# Altium schematic sheet MAX5875_6.SchDoc
size A; SheetNumber: 19; SheetTotal: 24
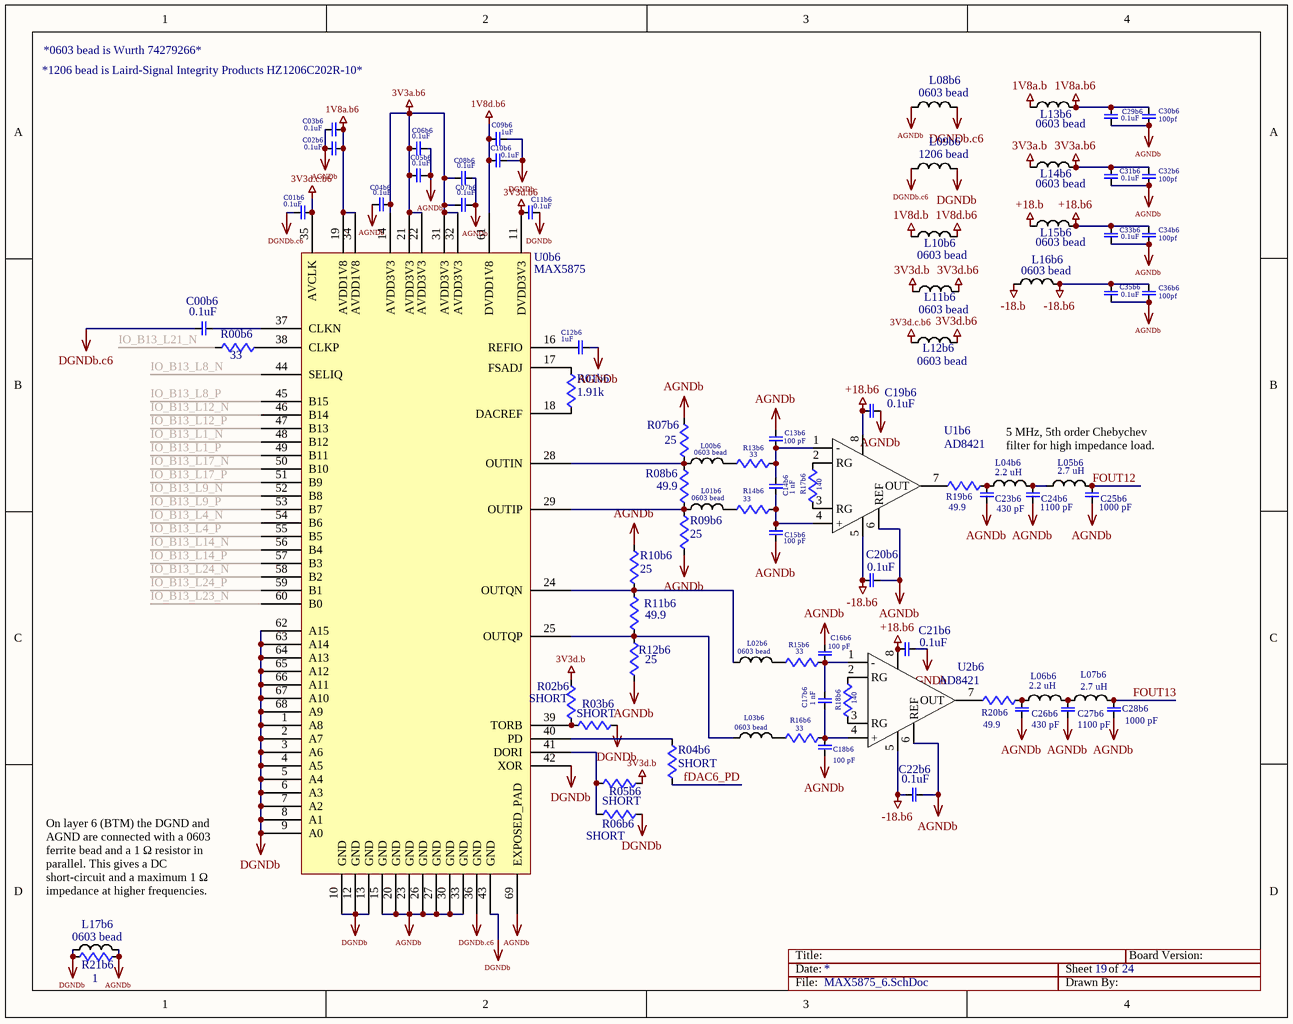
[diagram p0: MAX5875_6.SchDoc]

## Parts
C00b6  0.1uF  [0402]
C01b6  0.1uF  [0402]
C02b6  0.1uF  [0402]
C03b6  0.1uF  [0402]
C04b6  0.1uF  [0402]
C05b6  0.1uF  [0402]
C06b6  0.1uF  [0402]
C07b6  0.1uF  [0402]
C08b6  0.1uF  [0402]
C09b6  1uF  [0603]
C10b6  0.1uF  [0402]
C11b6  0.1uF  [0402]
C12b6  1uF  [0402]
C13b6  100 pF  [0603]
C14b6  1 nF  [0603]
C15b6  100 pF  [0603]
C16b6  100 pF  [0603]
C17b6  1 nF  [0603]
C18b6  100 pF  [0603]
C19b6  0.1uF  [0603]
C20b6  0.1uF  [0603]
C21b6  0.1uF  [0603]
C22b6  0.1uF  [0603]
C23b6  430 pF  [0603]
C24b6  1100 pF  [0603]
C25b6  1000 pF  [0603]
C26b6  430 pF  [0603]
C27b6  1100 pF  [0603]
C28b6  1000 pF  [0603]
C29b6  0.1uF  [0603]
C30b6  100pf  [0603]
C31b6  0.1uF  [0603]
C32b6  100pf  [0603]
C33b6  0.1uF  [0603]
C34b6  100pf  [0603]
C35b6  0.1uF  [0603]
C36b6  100pf  [0603]
L00b6  0603 bead  [0603]
L01b6  0603 bead  [0603]
L02b6  0603 bead  [0603]
L03b6  0603 bead  [0603]
L04b6  2.2 uH  [0603]
L05b6  2.7 uH  [0603]
L06b6  2.2 uH  [0603]
L07b6  2.7 uH  [0603]
L08b6  0603 bead  [0603]
L09b6  1206 bead  [1206]
L10b6  0603 bead  [0603]
L11b6  0603 bead  [0603]
L12b6  0603 bead  [0603]
L13b6  0603 bead  [0603]
L14b6  0603 bead  [0603]
L15b6  0603 bead  [0603]
L16b6  0603 bead  [0603]
L17b6  0603 bead  [0603]
R00b6  33  [0402]
R01b6  1.91k  [0603]
R02b6  SHORT  [0603]
R03b6  SHORT  [0603]
R04b6  SHORT  [0603]
R05b6  SHORT  [0603]
R06b6  SHORT  [0603]
R07b6  25  [0603]
R08b6  49.9  [0603]
R09b6  25  [0603]
R10b6  25  [0603]
R11b6  49.9  [0603]
R12b6  25  [0603]
R13b6  33  [0603]
R14b6  33  [0603]
R15b6  33  [0603]
R16b6  33  [0603]
R17b6  140  [0402]
R18b6  140  [0402]
R19b6  49.9  [0603]
R20b6  49.9  [0603]
R21b6  1  [0603]
U0b6  MAX5875  [68LQFN]
U1b6  AD8421  [8SOIC]
U2b6  AD8421  [8SOIC]

## Nets
1V8a.b: L13b6.1
1V8a.b6: C02b6.1 C03b6.2 C29b6.1 C30b6.1 L13b6.2 U0b6.19(AVDD1V8) U0b6.34(AVDD1V8)
1V8d.b: L10b6.1
1V8d.b6: C09b6.2 C10b6.2 L10b6.2 U0b6.61(DVDD1V8)
3V3a.b: L14b6.1
3V3a.b6: C04b6.1 C05b6.2 C06b6.1 C07b6.2 C08b6.1 C31b6.1 C32b6.1 L14b6.2 U0b6.14(AVDD3V3) U0b6.21(AVDD3V3) U0b6.22(AVDD3V3) U0b6.31(AVDD3V3) U0b6.32(AVDD3V3)
3V3d.b: L11b6.1 R02b6.2 R05b6.2
3V3d.b6: C11b6.2 L11b6.2 L12b6.2 U0b6.11(DVDD3V3)
3V3d.c.b6: C01b6.1 L12b6.1 U0b6.35(AVCLK)
+18.b: L15b6.1
+18.b6: C19b6.2 C21b6.2 C33b6.1 C34b6.1 L15b6.2 U1b6.8(+VS) U2b6.8(+VS)
-18.b: L16b6.1
-18.b6: C20b6.2 C22b6.2 C35b6.1 C36b6.1 L16b6.2 U1b6.5(-VS) U2b6.5(-VS)
AGNDb: C02b6.2 C03b6.1 C04b6.2 C05b6.1 C06b6.2 C07b6.1 C08b6.2 C12b6.1 C13b6.1 C15b6.1 C16b6.1 C18b6.1 C19b6.1 C20b6.1 C21b6.1 C22b6.1 C23b6.2 C24b6.2 C25b6.2 C26b6.2 C27b6.2 C28b6.2 C29b6.2 C30b6.2 C31b6.2 C32b6.2 C33b6.2 C34b6.2 C35b6.2 C36b6.2 L08b6.1 L17b6.2 R07b6.2 R09b6.1 R10b6.2 R12b6.1 R21b6.1 U0b6.15(GND) U0b6.20(GND) U0b6.23(GND) U0b6.26(GND) U0b6.27(GND) U0b6.30(GND) U0b6.33(GND) U0b6.69(EXPOSED_PAD) U1b6.6(REF) U2b6.6(REF)
DGNDb: C09b6.1 C10b6.1 C11b6.1 L09b6.2 L17b6.1 R03b6.2 R06b6.2 R21b6.2 U0b6.1(A8) U0b6.2(A7) U0b6.3(A6) U0b6.4(A5) U0b6.5(A4) U0b6.6(A3) U0b6.7(A2) U0b6.8(A1) U0b6.9(A0) U0b6.10(GND) U0b6.12(GND) U0b6.13(GND) U0b6.42(XOR) U0b6.43(GND) U0b6.62(A15) U0b6.63(A14) U0b6.64(A13) U0b6.65(A12) U0b6.66(A11) U0b6.67(A10) U0b6.68(A9)
DGNDb.c6: C00b6.2 C01b6.2 L08b6.2 L09b6.1 U0b6.36(GND)
fDAC6_PD: R04b6.2
FOUT12: C25b6.1 L05b6.2
FOUT13: C28b6.1 L07b6.2
IO_B13_L1_N: U0b6.48(B12)
IO_B13_L1_P: U0b6.49(B11)
IO_B13_L4_N: U0b6.54(B6)
IO_B13_L4_P: U0b6.55(B5)
IO_B13_L8_N: U0b6.44(SELIQ)
IO_B13_L8_P: U0b6.45(B15)
IO_B13_L9_N: U0b6.52(B8)
IO_B13_L9_P: U0b6.53(B7)
IO_B13_L12_N: U0b6.46(B14)
IO_B13_L12_P: U0b6.47(B13)
IO_B13_L14_N: U0b6.56(B4)
IO_B13_L14_P: U0b6.57(B3)
IO_B13_L17_N: U0b6.50(B10)
IO_B13_L17_P: U0b6.51(B9)
IO_B13_L21_N: R00b6.1
IO_B13_L23_N: U0b6.60(B0)
IO_B13_L24_N: U0b6.58(B2)
IO_B13_L24_P: U0b6.59(B1)
NetC00b6_1: C00b6.1 U0b6.37(CLKN)
NetC12b6_2: C12b6.2 U0b6.16(REFIO)
NetC13b6_2: C13b6.2 C14b6.1 R13b6.1 U1b6.1(-)
NetC14b6_2: C14b6.2 C15b6.2 R14b6.1 U1b6.4(+)
NetC16b6_2: C16b6.2 C17b6.1 R15b6.1 U2b6.1(-)
NetC17b6_2: C17b6.2 C18b6.2 R16b6.1 U2b6.4(+)
NetC23b6_1: C23b6.1 L04b6.1 R19b6.2
NetC24b6_1: C24b6.1 L04b6.2 L05b6.1
NetC26b6_1: C26b6.1 L06b6.1 R20b6.2
NetC27b6_1: C27b6.1 L06b6.2 L07b6.1
NetL00b6_1: L00b6.1 R07b6.1 R08b6.2 U0b6.28(OUTIN)
NetL00b6_2: L00b6.2 R13b6.2
NetL01b6_1: L01b6.1 R08b6.1 R09b6.2 U0b6.29(OUTIP)
NetL01b6_2: L01b6.2 R14b6.2
NetL02b6_1: L02b6.1 R10b6.1 R11b6.2 U0b6.24(OUTQN)
NetL02b6_2: L02b6.2 R15b6.2
NetL03b6_1: L03b6.1 R11b6.1 R12b6.2 U0b6.25(OUTQP)
NetL03b6_2: L03b6.2 R16b6.2
NetR00b6_2: R00b6.2 U0b6.38(CLKP)
NetR01b6_1: R01b6.1 U0b6.18(DACREF)
NetR01b6_2: R01b6.2 U0b6.17(FSADJ)
NetR02b6_1: R02b6.1 R03b6.1 U0b6.39(TORB)
NetR04b6_1: R04b6.1 U0b6.40(PD)
NetR05b6_1: R05b6.1 R06b6.1 U0b6.41(DORI)
NetR17b6_1: R17b6.1 U1b6.3(RG)
NetR17b6_2: R17b6.2 U1b6.2(RG)
NetR18b6_1: R18b6.1 U2b6.3(RG)
NetR18b6_2: R18b6.2 U2b6.2(RG)
NetR19b6_1: R19b6.1 U1b6.7(OUT)
NetR20b6_1: R20b6.1 U2b6.7(OUT)

## Notes on the sheet
- *1206 bead is Laird-Signal Integrity Products HZ1206C202R-10*
- *0603 bead is Wurth 74279266*
- 5 MHz, 5th order Chebychev filter for high impedance load.
- On layer 6 (BTM) the DGND and AGND are connected with a 0603 ferrite bead and a 1 Ω resistor in parallel. This gives a DC short-circuit and a maximum 1 Ω impedance at higher frequencies.
- Title:
- Date:
- Sheet
- of
- Board Version:
- File:
- Drawn By:

## Library data of the parts
C00b6 C01b6 C02b6 C03b6 C04b6 C05b6 C06b6 C07b6 C08b6 C09b6 C10b6 C11b6 C12b6 C13b6 C14b6 C15b6 C16b6 C17b6 C18b6 C19b6 C20b6 C21b6 C22b6 C23b6 C24b6 C25b6 C26b6 C27b6 C28b6 C29b6 C30b6 C31b6 C32b6 C33b6 C34b6 C35b6 C36b6 = CAP
L00b6 L01b6 L02b6 L03b6 L04b6 L05b6 L06b6 L07b6 L08b6 L09b6 L10b6 L11b6 L12b6 L13b6 L14b6 L15b6 L16b6 L17b6 = INDUCTOR
R00b6 R01b6 R02b6 R03b6 R04b6 R05b6 R06b6 R07b6 R08b6 R09b6 R10b6 R11b6 R12b6 R13b6 R14b6 R15b6 R16b6 R17b6 R18b6 R19b6 R20b6 R21b6 = RES